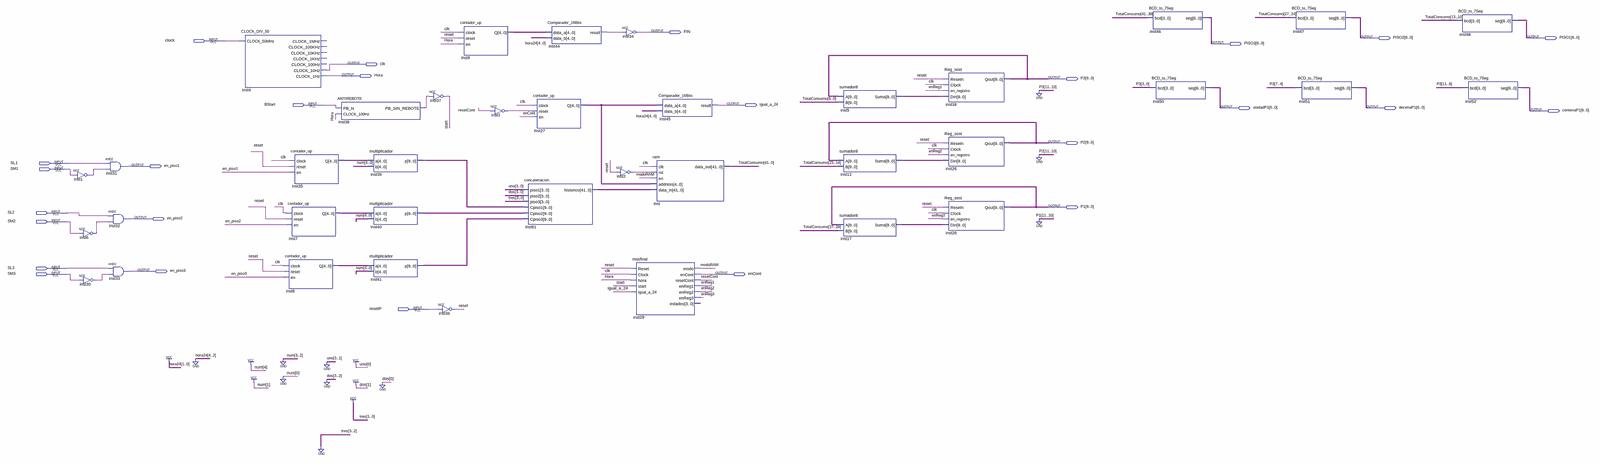
[diagram p0: schematic sheet, whole]
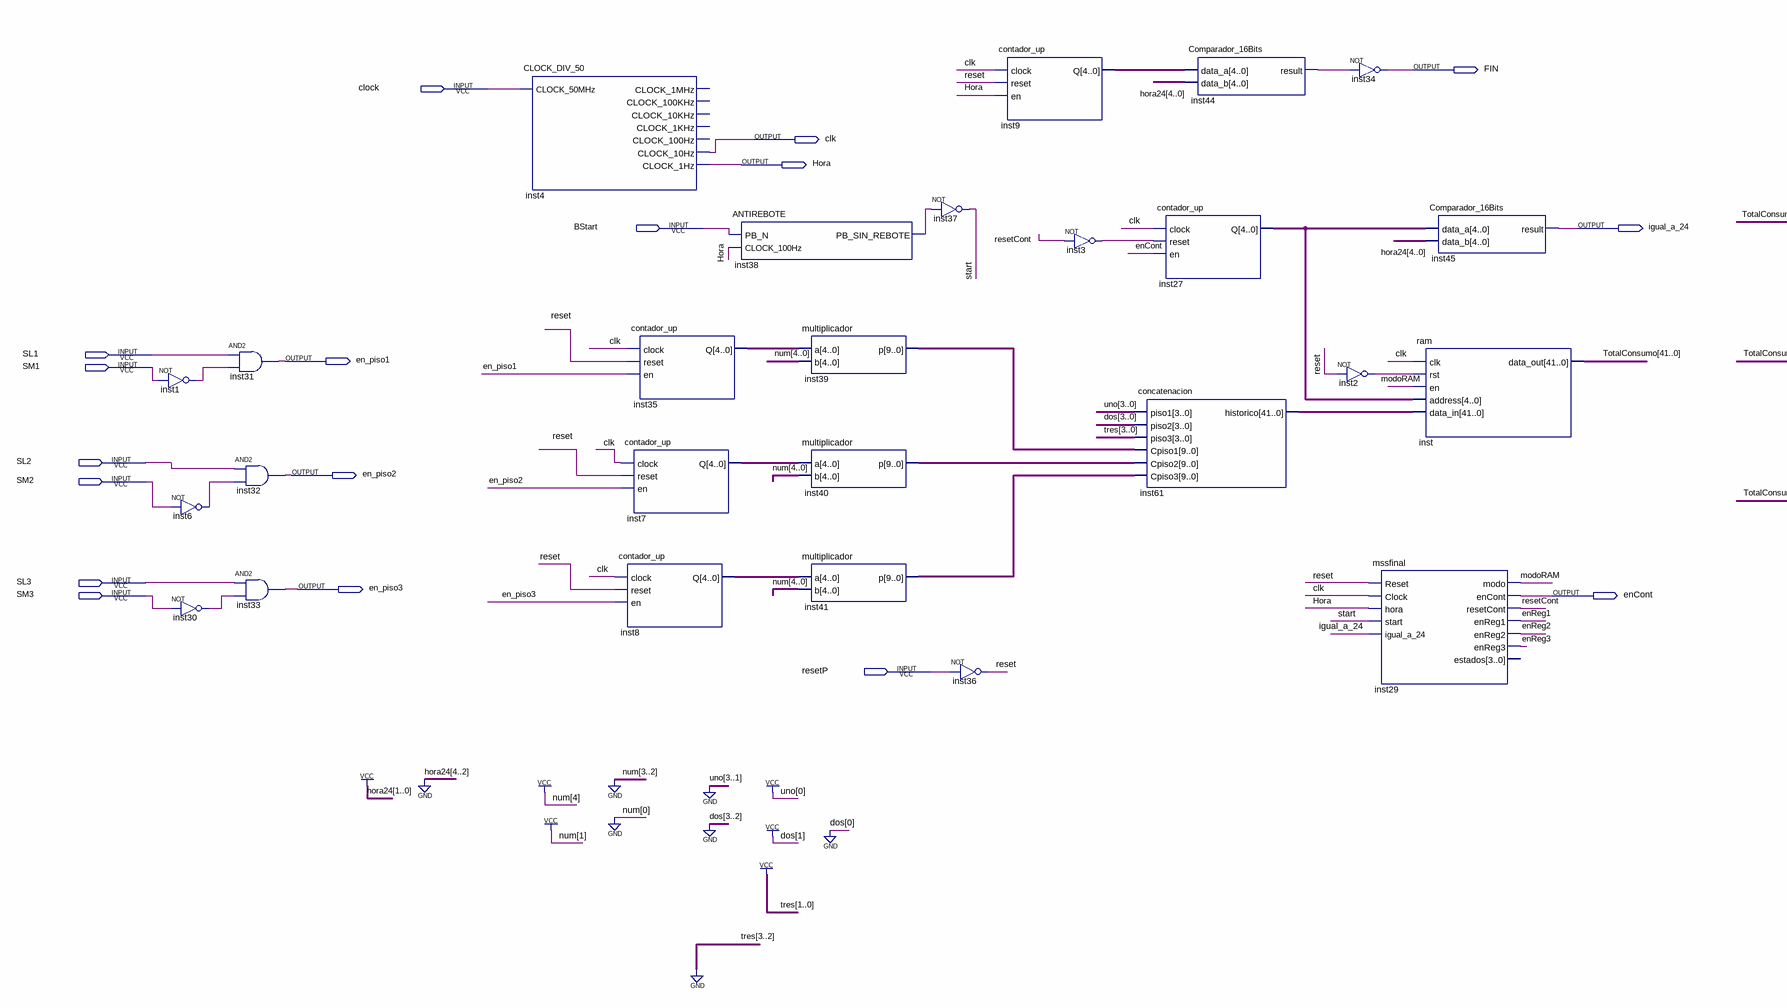
[diagram p1: schematic sheet, left part]
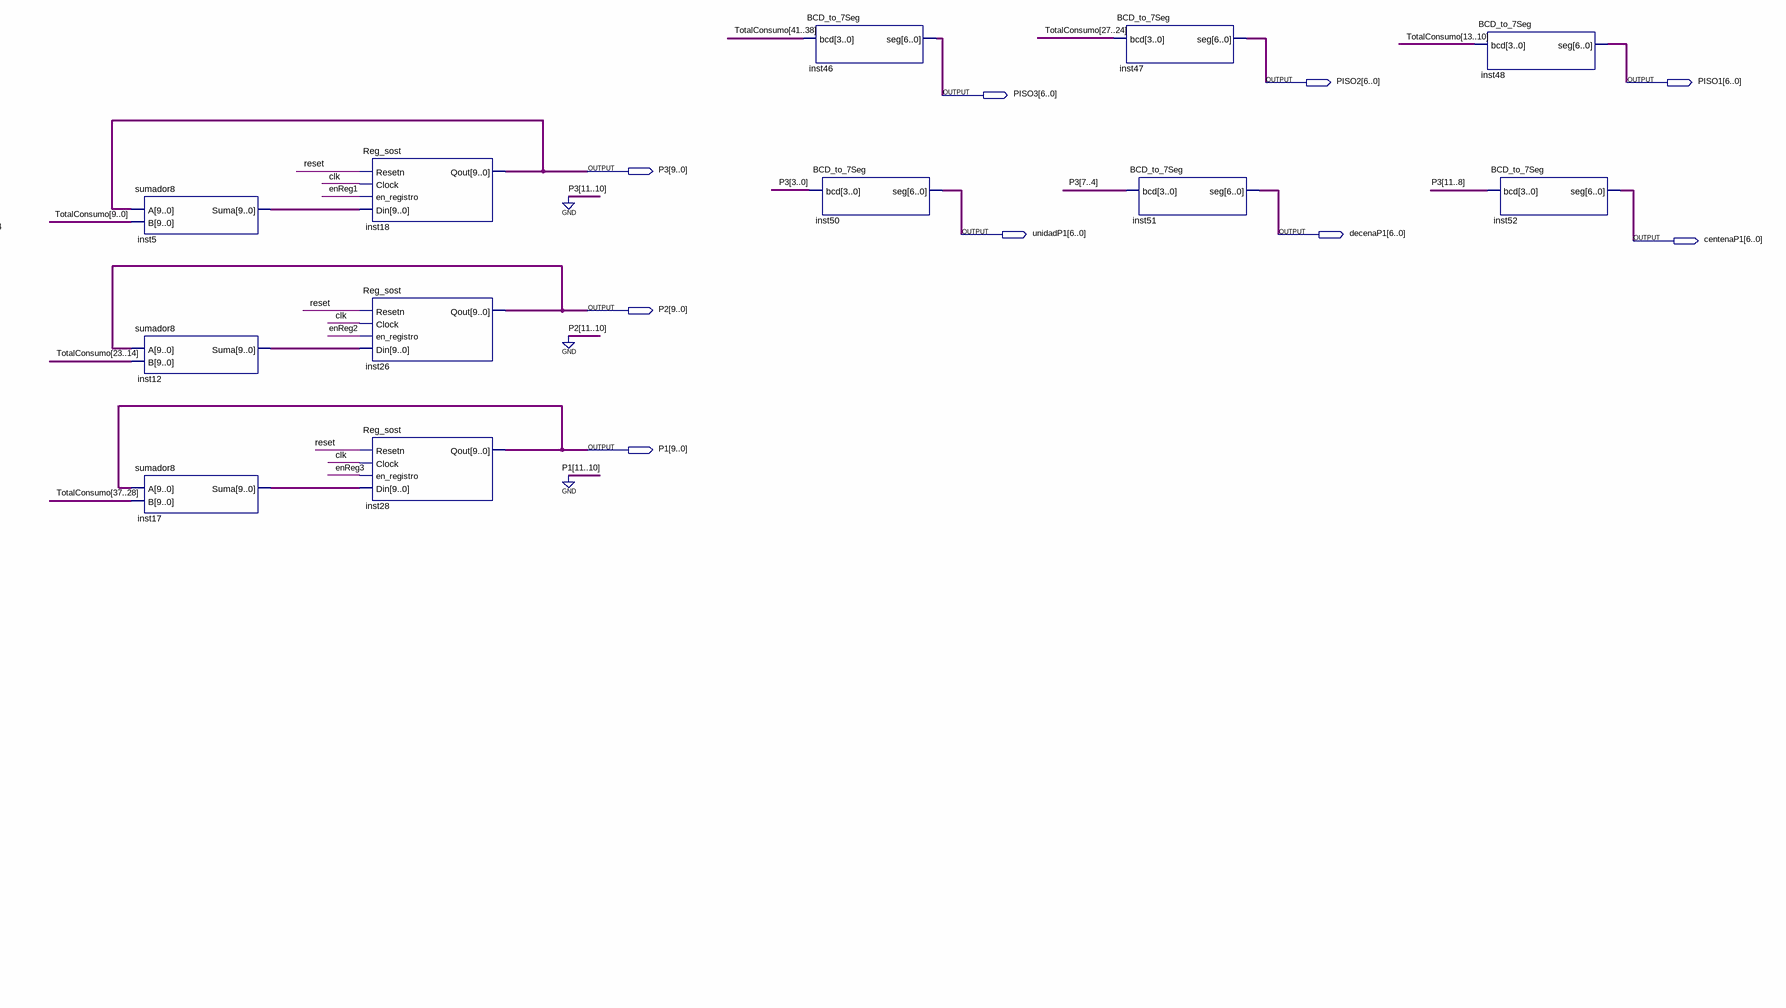
[diagram p2: schematic sheet, right part]
// Quartus schematic Proyecto.bdf as structural Verilog: 38 symbols, 26 pins
module Proyecto (
  input  clock,
  input  BStart,
  input  SL1,
  input  SM1,
  input  SL2,
  input  SM2,
  input  SL3,
  input  SM3,
  input  resetP,
  output FIN,
  output [6:0] PISO2,
  output [6:0] PISO1,
  output [6:0] PISO3,
  output clk,
  output Hora,
  output [9:0] P3,
  output igual_a_24,
  output [6:0] unidadP1,
  output [6:0] decenaP1,
  output [6:0] centenaP1,
  output [9:0] P2,
  output en_piso1,
  output [9:0] P1,
  output en_piso2,
  output en_piso3,
  output enCont
);

  wire enReg1, enReg2, enReg3, inst1_out, inst2_out, inst3_out, inst6_out, inst30_out, inst38_pb_sin_rebote,
       inst44_result, modoRAM, reset, resetCont, start;
  wire [4:0] inst7_q, inst8_q, inst9_q, inst27_q, inst35_q;
  wire [9:0] inst5_suma, inst12_suma, inst17_suma, inst39_p, inst40_p, inst41_p;
  wire [41:0] inst61_historico, TotalConsumo;

  not inst1 (inst1_out, SM1);
  not inst6 (inst6_out, SM2);
  not inst30 (inst30_out, SM3);
  and inst31 (en_piso1, SL1, inst1_out);
  and inst32 (en_piso2, SL2, inst6_out);
  and inst33 (en_piso3, SL3, inst30_out);
  CLOCK_DIV_50 inst4 (
    .CLOCK_50MHz(clock), .CLOCK_10Hz(clk), .CLOCK_1Hz(Hora));  // open: CLOCK_1MHz, CLOCK_100KHz, CLOCK_10KHz, CLOCK_1KHz, CLOCK_100Hz
  contador_up inst35 (.clock(clk), .reset(reset), .en(en_piso1), .Q(inst35_q));
  contador_up inst7 (.clock(clk), .reset(reset), .en(en_piso2), .Q(inst7_q));
  contador_up inst8 (.clock(clk), .reset(reset), .en(en_piso3), .Q(inst8_q));
  ANTIREBOTE inst38 (.PB_N(BStart), .CLOCK_100Hz(Hora), .PB_SIN_REBOTE(inst38_pb_sin_rebote));
  multiplicador inst39 (.a(inst35_q), .b(5'b10010), .p(inst39_p));
  multiplicador inst40 (.a(inst7_q), .b(5'b10010), .p(inst40_p));
  multiplicador inst41 (.a(inst8_q), .b(5'b10010), .p(inst41_p));
  not inst37 (start, inst38_pb_sin_rebote);
  not inst36 (reset, resetP);
  contador_up inst9 (.clock(clk), .reset(reset), .en(Hora), .Q(inst9_q));
  not inst3 (inst3_out, resetCont);
  concatenacion inst61 (
    .piso1(4'b0001), .piso2(4'b0010), .piso3(4'b0011), .Cpiso1(inst39_p), .Cpiso2(inst40_p),
    .Cpiso3(inst41_p), .historico(inst61_historico));
  Comparador_16Bits inst44 (.data_a(inst9_q), .data_b(5'b00011), .result(inst44_result));
  contador_up inst27 (.clock(clk), .reset(inst3_out), .en(enCont), .Q(inst27_q));
  not inst2 (inst2_out, reset);
  not inst34 (FIN, inst44_result);
  mssfinal inst29 (
    .Reset(reset), .Clock(clk), .hora(Hora), .start(start), .igual_a_24(igual_a_24), .modo(modoRAM),
    .enCont(enCont), .resetCont(resetCont), .enReg1(enReg1), .enReg2(enReg2), .enReg3(enReg3));  // open: estados
  Comparador_16Bits inst45 (.data_a(inst27_q), .data_b(5'b00011), .result(igual_a_24));
  ram inst (
    .clk(clk), .rst(inst2_out), .en(modoRAM), .address(inst27_q), .data_in(inst61_historico),
    .data_out(TotalConsumo));
  sumador8 inst5 (.A(P3), .B(TotalConsumo[9:0]), .Suma(inst5_suma));
  sumador8 inst12 (.A(P2), .B(TotalConsumo[23:14]), .Suma(inst12_suma));
  sumador8 inst17 (.A(P1), .B(TotalConsumo[37:28]), .Suma(inst17_suma));
  Reg_sost inst18 (.Resetn(reset), .Clock(clk), .en_registro(enReg1), .Din(inst5_suma), .Qout(P3));
  Reg_sost inst26 (.Resetn(reset), .Clock(clk), .en_registro(enReg2), .Din(inst12_suma), .Qout(P2));
  Reg_sost inst28 (.Resetn(reset), .Clock(clk), .en_registro(enReg3), .Din(inst17_suma), .Qout(P1));
  BCD_to_7Seg inst46 (.bcd(TotalConsumo[41:38]), .seg(PISO3));
  BCD_to_7Seg inst50 (.bcd(P3[3:0]), .seg(unidadP1));
  BCD_to_7Seg inst47 (.bcd(TotalConsumo[27:24]), .seg(PISO2));
  BCD_to_7Seg inst51 (.bcd(P3[7:4]), .seg(decenaP1));
  BCD_to_7Seg inst48 (.bcd(TotalConsumo[13:10]), .seg(PISO1));
  BCD_to_7Seg inst52 (.bcd({2'b00, P3[9:8]}), .seg(centenaP1));
endmodule
